# EAGLE design pixel (EAGLE 6.6.0)
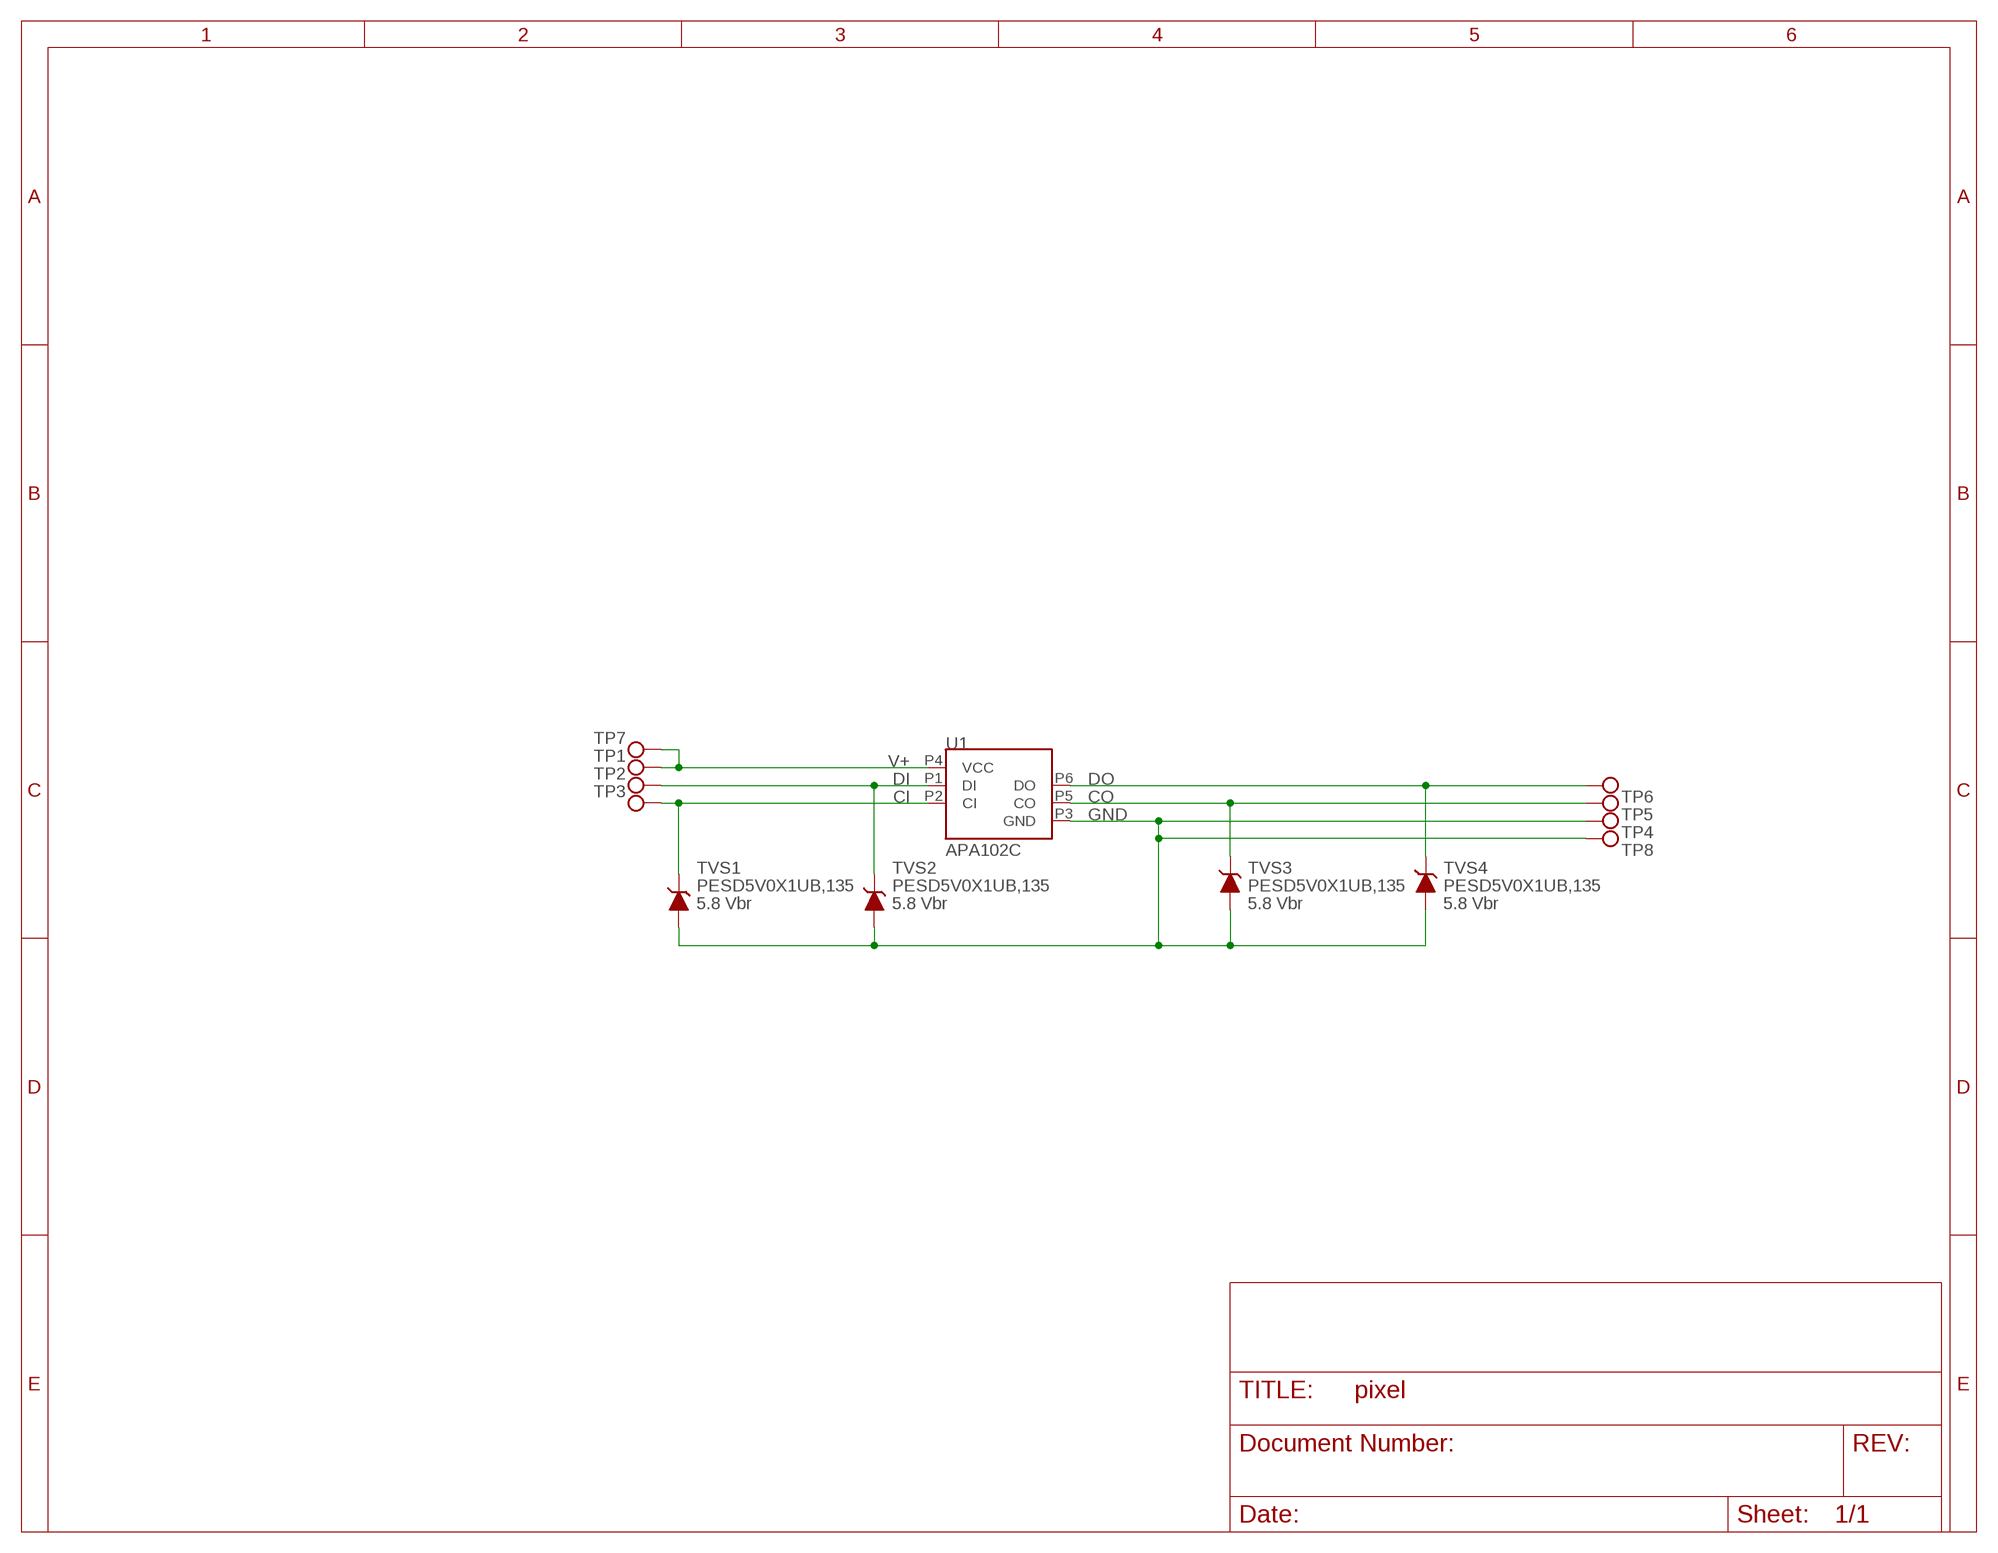
[diagram p0: schematic, sheet 1]

## Parts
TP1  TP_1P6_MM_ROUND  [TP_1P6_MM_ROUND]
TP2  TP_1P6_MM_ROUND  [TP_1P6_MM_ROUND]
TP3  TP_1P6_MM_ROUND  [TP_1P6_MM_ROUND]
TP4  TP_1P6_MM_ROUND  [TP_1P6_MM_ROUND]
TP5  TP_1P6_MM_ROUND  [TP_1P6_MM_ROUND]
TP6  TP_1P6_MM_ROUND  [TP_1P6_MM_ROUND]
TP7  TP_1P6_MM_ROUND  [TP_1P6_MM_ROUND]
TP8  TP_1P6_MM_ROUND  [TP_1P6_MM_ROUND]
TVS1  PESD5V0X1UB,135  [SOD523]
TVS2  PESD5V0X1UB,135  [SOD523]
TVS3  PESD5V0X1UB,135  [SOD523]
TVS4  PESD5V0X1UB,135  [SOD523]
U1  APA102C  [APA102C]

## Nets
CI: TP3.P$1(P1) TVS1.K U1.P2(CI)
CO: TP5.P$1(P1) TVS3.K U1.P5(CO)
DI: TP2.P$1(P1) TVS2.K U1.P1(DI)
DO: TP6.P$1(P1) TVS4.K U1.P6(DO)
GND: TP4.P$1(P1) TP8.P$1(P1) TVS1.A TVS2.A TVS3.A TVS4.A U1.P3(GND)
V+: TP1.P$1(P1) TP7.P$1(P1) U1.P4(VCC)

## Library data of the parts
TP1-TP8 = wedfestdress:TP_1P6_MM_ROUND: Test Point 1.6 mm Round; DESCRIPTION: Test point, SMT, circular, 1.6 mm diameter; DISPLAY: Test Point
TVS1-TVS4 = wedfestdress:PESD5V0X1UB,135; COST_X1: 0.45; COST_X100: 0.288; COST_X500: 0.22626; DESCRIPTION: TVS diode, 5 Vs, 5.8 Vbr, 8 Vcl, 0.95 pF, 8 kV, 200 mW; DISPLAY: 5.8 Vbr; DISTRIBUTOR: Digikey; DIST_PART_NO: 1727-5906-1-ND; MFG: NXP; MFG_PART_NO: PESD5V0X1UB,135; PACKAGE: SOD523
U1 = wedfestdress:APA102C; COST_X1: .23; COST_X100: .23; COST_X500: .23; DESCRIPTION: RGB LED, daisy-chainable, SPI-compatible, 5050 case size; DISTRIBUTOR: Amazon; DIST_PART_NO: B01MG4TG58; MFG: iPixel; MFG_PART_NO: APA102C; PACKAGE: 5050

## Board
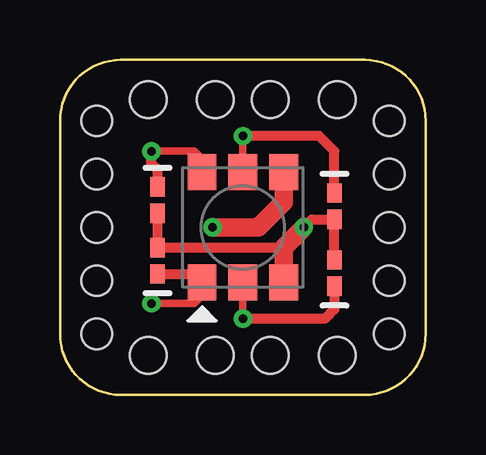
[diagram p1: board, top side]
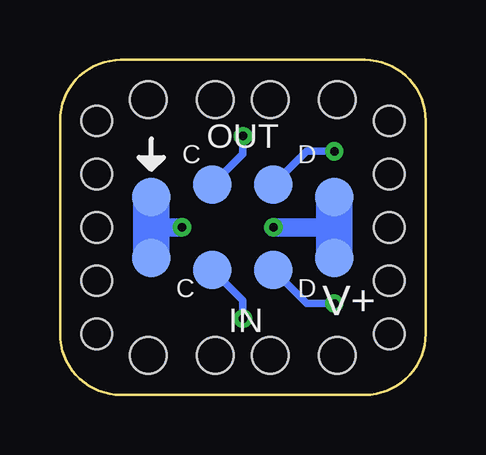
[diagram p2: board, bottom side, seen from below]

Size 15.24 x 13.97 mm. Coordinates in mm from the lower left corner, seen from the top.
Outline: 0,11.43 0,2.54 arc90 2.54,0 12.7,0 arc90 15.24,2.54 15.24,11.43 arc90 12.7,13.97 2.54,13.97 arc90 0,11.43
Copper layers (1*16): Top 0.035mm / dielectric 1.5mm / Bottom 0.035mm
Design rules "default *": minimum track width 6mil, minimum drill 14mil, track to track 6mil, track to pad 6mil, pad to pad 6mil, via to via 6mil, smd to smd 0mil, copper to edge 20mil, drill to drill 8mil, minimum pad ring 10mil, minimum via ring 8mil, stop-mask expansion 3mil, vias tented up to drill 16mil, thermal gap 10mil
Holes 1.52 mm at 3.68,1.65 3.68,12.32 11.56,12.32 11.56,1.65 6.48,1.65 8.76,1.65 6.48,12.32 8.76,12.32
Holes 1.27 mm at 13.72,11.43 13.72,2.54 13.72,6.99 13.72,9.21 13.72,4.76 1.52,2.54 1.52,6.99 1.52,11.43 1.52,9.21 1.52,4.76

### Footprints (pad centres in the part's own frame; a part is rotated, then mirrored left to right if it is on the bottom)
TP_1P6_MM_ROUND = smd 1.6 x 1.6: P$1 0,0
SOD523 = smd 0.8 x 0.6: A -0.55,0; K 0.55,0
APA102C = smd 1.5 x 1.2: P1 -2.3,1.7; P2 -2.3,0; P3 -2.3,-1.7; P4 2.3,-1.7; P5 2.3,0; P6 2.3,1.7

### Placement (x,y rotation side)
TP1  3.81,8.26 0 bottom
TP2  6.35,5.21 0 bottom
TP3  8.89,5.21 0 bottom
TP4  11.43,5.71 0 bottom
TP5  8.89,8.76 0 bottom
TP6  6.35,8.76 0 bottom
TP7  3.81,5.71 0 bottom
TP8  11.43,8.26 0 bottom
TVS1  11.43,5.08 270 top
TVS2  4.06,5.59 270 top
TVS3  11.43,7.87 90 top
TVS4  4.06,8.13 90 top
U1  7.62,6.99 90 top

### Tracks (layer width: path | path; a pad name or v marks a point on that pad's centre or on a via)
CI  (via drill 0.36)
  Top 0.305: U1.P2 v7.62,3.17
  Top 0.406: TVS1.K 11.43,3.56 11.05,3.17 v7.62,3.17
  Bottom 0.305: v7.62,3.17 7.62,3.94 TP3.P$1
CO  (via drill 0.36)
  Top 0.305: v7.62,10.79 U1.P5
  Top 0.406: TVS3.K 11.43,10.16 10.79,10.79 v7.62,10.79
  Bottom 0.305: v7.62,10.79 7.62,10.03 TP5.P$1
DI  (via drill 0.36)
  Top 0.305: U1.P1 5.92,4.14 5.59,3.81 v3.81,3.81
  Top 0.406: TVS2.K 5.92,5.04 U1.P1
  Bottom 0.305: v3.81,3.81 4.95,3.81 TP2.P$1
DO  (via drill 0.36)
  Top 0.305: U1.P6 5.92,9.83 5.59,10.16 v3.81,10.16
  Top 0.406: TVS4.K 4.06,9.4 3.81,9.65 v3.81,10.16
  Bottom 0.305: v3.81,10.16 4.95,10.16 TP6.P$1
GND  (via drill 0.36)
  Top 0.406: 9.32,6.14 TVS2.A TVS4.A | TVS1.A TVS3.A 10.5,7.32 v10.16,6.99
  Top 0.762: U1.P3 9.32,6.14 v10.16,6.99
  Bottom 0.762: v10.16,6.99 11.43,6.99
  Bottom 1.524: TP8.P$1 11.43,6.99 TP4.P$1
V+  (via drill 0.36)
  Top 0.762: U1.P4 9.32,8.05 8.26,6.99 v6.35,6.99
  Bottom 0.762: v6.35,6.99 3.81,6.99
  Bottom 1.524: TP1.P$1 3.81,6.99 TP7.P$1

### Text on the board
bPlace: D | OUT | C | D | C | V+ | IN